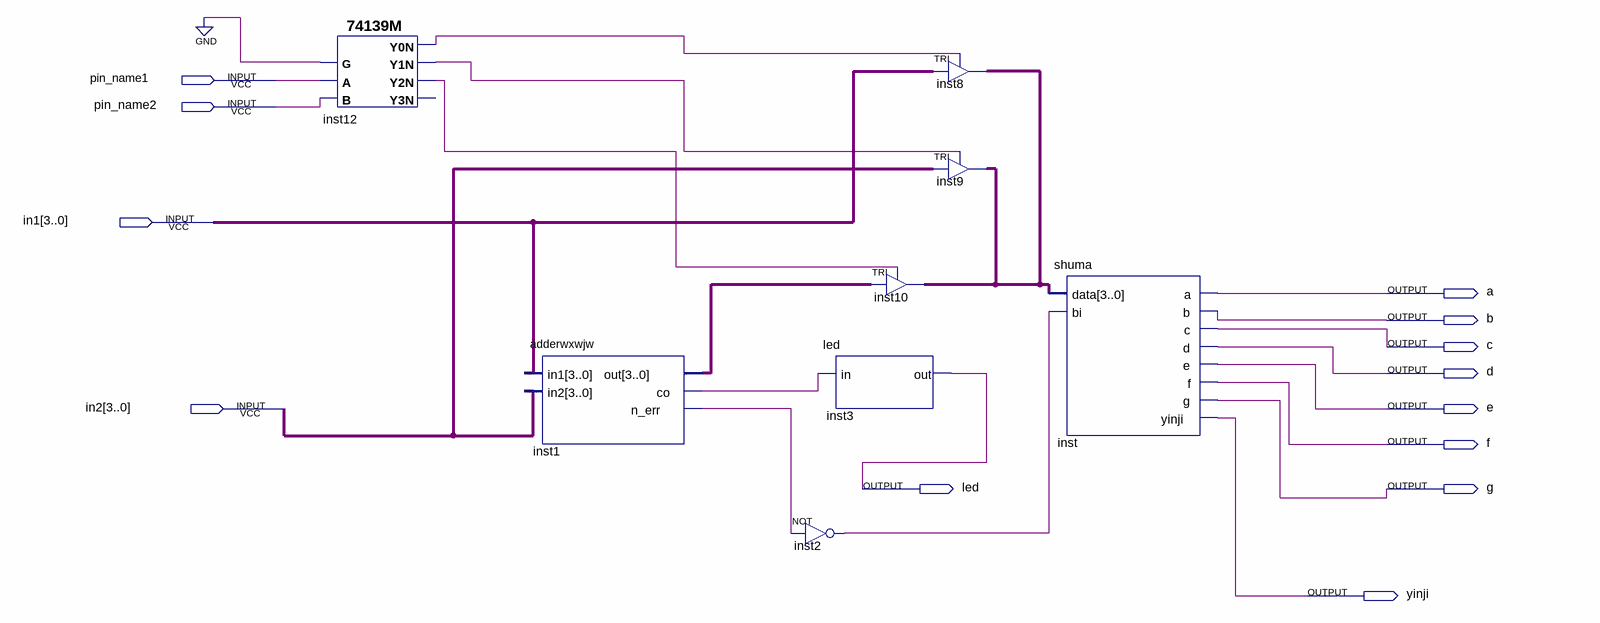
[diagram p0: schematic sheet]
// Quartus schematic Block1.bdf as structural Verilog: 8 symbols, 13 pins
module Block1 (
  input  pin_name1,
  input  pin_name2,
  input  [3:0] in1,
  input  [3:0] in2,
  output a,
  output b,
  output c,
  output d,
  output e,
  output f,
  output led,
  output g,
  output yinji
);

  wire inst1_co, inst1_n_err, inst2_out, inst12_y0n, inst12_y1n, inst12_y2n;
  wire [3:0] inst1_out, inst10_out;

  \74139M  inst12 (
    .B(pin_name2), .A(pin_name1), .G(1'b0), .Y2N(inst12_y2n), .Y0N(inst12_y0n), .Y1N(inst12_y1n));  // open: Y3N
  adderwxwjw inst1 (.in1(in1), .in2(in2), .out(inst1_out), .co(inst1_co), .n_err(inst1_n_err));
  not inst2 (inst2_out, inst1_n_err);
  TRI inst10[3:0] (.IN(inst1_out), .OE(inst12_y2n), .OUT(inst10_out));
  led inst3 (.in(inst1_co), .out(led));
  TRI inst8[3:0] (.IN(in1), .OE(inst12_y0n), .OUT(inst10_out));
  TRI inst9[3:0] (.IN(in2), .OE(inst12_y1n), .OUT(inst10_out));
  shuma inst (.data(inst10_out), .bi(inst2_out), .a(a), .b(b), .c(c), .d(d), .e(e), .f(f), .g(g), .yinji(yinji));
endmodule
